# Altium schematic sheet base_led_cube.SchDoc
size A4
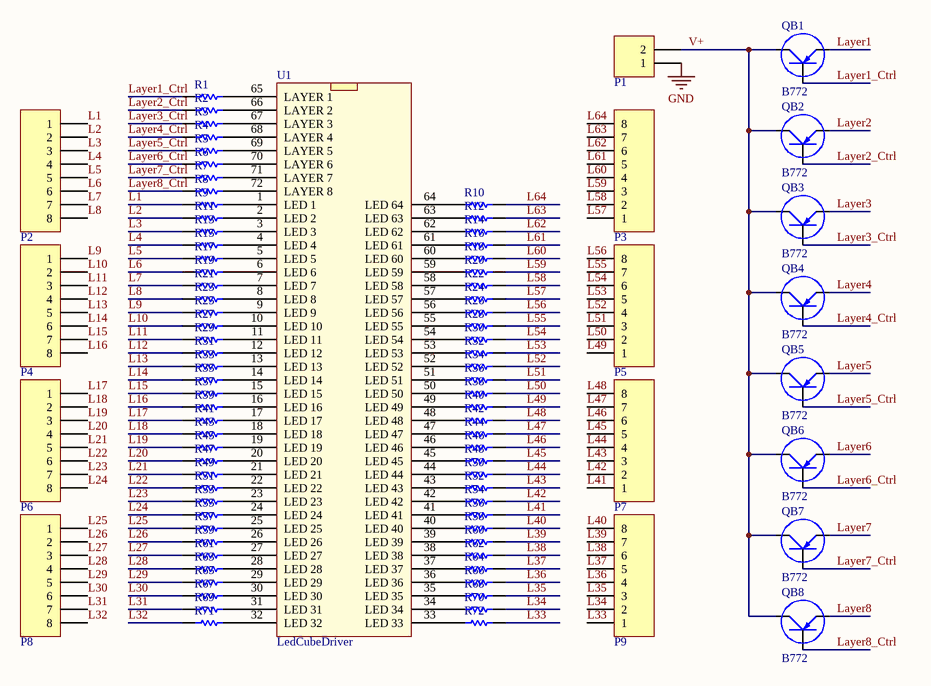
[diagram p0: base_led_cube.SchDoc]

## Parts
P1  Domino 2  [DOMINO SMALL 2]  (value not drawn)
P2  Header 8  [JP8]  (value not drawn)
P3  Header 8  [JP8]  (value not drawn)
P4  Header 8  [JP8]  (value not drawn)
P5  Header 8  [JP8]  (value not drawn)
P6  Header 8  [JP8]  (value not drawn)
P7  Header 8  [JP8]  (value not drawn)
P8  Header 8  [JP8]  (value not drawn)
P9  Header 8  [JP8]  (value not drawn)
QB1  B772  [To-126]
QB2  B772  [To-126]
QB3  B772  [To-126]
QB4  B772  [To-126]
QB5  B772  [To-126]
QB6  B772  [To-126]
QB7  B772  [To-126]
QB8  B772  [To-126]
R1  RESISTOR SMD  [RES-SM-0805]  (value not drawn)
R2  RESISTOR SMD  [RES-SM-0805]  (value not drawn)
R3  RESISTOR SMD  [RES-SM-0805]  (value not drawn)
R4  RESISTOR SMD  [RES-SM-0805]  (value not drawn)
R5  RESISTOR SMD  [RES-SM-0805]  (value not drawn)
R6  RESISTOR SMD  [RES-SM-0805]  (value not drawn)
R7  RESISTOR SMD  [RES-SM-0805]  (value not drawn)
R8  RESISTOR SMD  [RES-SM-0805]  (value not drawn)
R9  RESISTOR SMD  [RES-SM-0805]  (value not drawn)
R10  RESISTOR SMD  [RES-SM-0805]  (value not drawn)
R11  RESISTOR SMD  [RES-SM-0805]  (value not drawn)
R12  RESISTOR SMD  [RES-SM-0805]  (value not drawn)
R13  RESISTOR SMD  [RES-SM-0805]  (value not drawn)
R14  RESISTOR SMD  [RES-SM-0805]  (value not drawn)
R15  RESISTOR SMD  [RES-SM-0805]  (value not drawn)
R16  RESISTOR SMD  [RES-SM-0805]  (value not drawn)
R17  RESISTOR SMD  [RES-SM-0805]  (value not drawn)
R18  RESISTOR SMD  [RES-SM-0805]  (value not drawn)
R19  RESISTOR SMD  [RES-SM-0805]  (value not drawn)
R20  RESISTOR SMD  [RES-SM-0805]  (value not drawn)
R21  RESISTOR SMD  [RES-SM-0805]  (value not drawn)
R22  RESISTOR SMD  [RES-SM-0805]  (value not drawn)
R23  RESISTOR SMD  [RES-SM-0805]  (value not drawn)
R24  RESISTOR SMD  [RES-SM-0805]  (value not drawn)
R25  RESISTOR SMD  [RES-SM-0805]  (value not drawn)
R26  RESISTOR SMD  [RES-SM-0805]  (value not drawn)
R27  RESISTOR SMD  [RES-SM-0805]  (value not drawn)
R28  RESISTOR SMD  [RES-SM-0805]  (value not drawn)
R29  RESISTOR SMD  [RES-SM-0805]  (value not drawn)
R30  RESISTOR SMD  [RES-SM-0805]  (value not drawn)
R31  RESISTOR SMD  [RES-SM-0805]  (value not drawn)
R32  RESISTOR SMD  [RES-SM-0805]  (value not drawn)
R33  RESISTOR SMD  [RES-SM-0805]  (value not drawn)
R34  RESISTOR SMD  [RES-SM-0805]  (value not drawn)
R35  RESISTOR SMD  [RES-SM-0805]  (value not drawn)
R36  RESISTOR SMD  [RES-SM-0805]  (value not drawn)
R37  RESISTOR SMD  [RES-SM-0805]  (value not drawn)
R38  RESISTOR SMD  [RES-SM-0805]  (value not drawn)
R39  RESISTOR SMD  [RES-SM-0805]  (value not drawn)
R40  RESISTOR SMD  [RES-SM-0805]  (value not drawn)
R41  RESISTOR SMD  [RES-SM-0805]  (value not drawn)
R42  RESISTOR SMD  [RES-SM-0805]  (value not drawn)
R43  RESISTOR SMD  [RES-SM-0805]  (value not drawn)
R44  RESISTOR SMD  [RES-SM-0805]  (value not drawn)
R45  RESISTOR SMD  [RES-SM-0805]  (value not drawn)
R46  RESISTOR SMD  [RES-SM-0805]  (value not drawn)
R47  RESISTOR SMD  [RES-SM-0805]  (value not drawn)
R48  RESISTOR SMD  [RES-SM-0805]  (value not drawn)
R49  RESISTOR SMD  [RES-SM-0805]  (value not drawn)
R50  RESISTOR SMD  [RES-SM-0805]  (value not drawn)
R51  RESISTOR SMD  [RES-SM-0805]  (value not drawn)
R52  RESISTOR SMD  [RES-SM-0805]  (value not drawn)
R53  RESISTOR SMD  [RES-SM-0805]  (value not drawn)
R54  RESISTOR SMD  [RES-SM-0805]  (value not drawn)
R55  RESISTOR SMD  [RES-SM-0805]  (value not drawn)
R56  RESISTOR SMD  [RES-SM-0805]  (value not drawn)
R57  RESISTOR SMD  [RES-SM-0805]  (value not drawn)
R58  RESISTOR SMD  [RES-SM-0805]  (value not drawn)
R59  RESISTOR SMD  [RES-SM-0805]  (value not drawn)
R60  RESISTOR SMD  [RES-SM-0805]  (value not drawn)
R61  RESISTOR SMD  [RES-SM-0805]  (value not drawn)
R62  RESISTOR SMD  [RES-SM-0805]  (value not drawn)
R63  RESISTOR SMD  [RES-SM-0805]  (value not drawn)
R64  RESISTOR SMD  [RES-SM-0805]  (value not drawn)
R65  RESISTOR SMD  [RES-SM-0805]  (value not drawn)
R66  RESISTOR SMD  [RES-SM-0805]  (value not drawn)
R67  RESISTOR SMD  [RES-SM-0805]  (value not drawn)
R68  RESISTOR SMD  [RES-SM-0805]  (value not drawn)
R69  RESISTOR SMD  [RES-SM-0805]  (value not drawn)
R70  RESISTOR SMD  [RES-SM-0805]  (value not drawn)
R71  RESISTOR SMD  [RES-SM-0805]  (value not drawn)
R72  RESISTOR SMD  [RES-SM-0805]  (value not drawn)
U1  LedCubeDriver  [LED CUBE Driver]

## Nets
GND: P1.1
L1: P2.1 R9.1
L2: P2.2 R11.1
L3: P2.3 R13.1
L4: P2.4 R15.1
L5: P2.5 R17.1
L6: P2.6 R19.1
L7: P2.7 R21.1
L8: P2.8 R23.1
L9: P4.1 R25.1
L10: P4.2 R27.1
L11: P4.3 R29.1
L12: P4.4 R31.1
L13: P4.5 R33.1
L14: P4.6 R35.1
L15: P4.7 R37.1
L16: P4.8 R39.1
L17: P6.1 R41.1
L18: P6.2 R43.1
L19: P6.3 R45.1
L20: P6.4 R47.1
L21: P6.5 R49.1
L22: P6.6 R51.1
L23: P6.7 R53.1
L24: P6.8 R55.1
L25: P8.1 R57.1
L26: P8.2 R59.1
L27: P8.3 R61.1
L28: P8.4 R63.1
L29: P8.5 R65.1
L30: P8.6 R67.1
L31: P8.7 R69.1
L32: P8.8 R71.1
L33: P9.1 R72.1
L34: P9.2 R70.1
L35: P9.3 R68.1
L36: P9.4 R66.1
L37: P9.5 R64.1
L38: P9.6 R62.1
L39: P9.7 R60.1
L40: P9.8 R58.1
L41: P7.1 R56.1
L42: P7.2 R54.1
L43: P7.3 R52.1
L44: P7.4 R50.1
L45: P7.5 R48.1
L46: P7.6 R46.1
L47: P7.7 R44.1
L48: P7.8 R42.1
L49: P5.1 R40.1
L50: P5.2 R38.1
L51: P5.3 R36.1
L52: P5.4 R34.1
L53: P5.5 R32.1
L54: P5.6 R30.1
L55: P5.7 R28.1
L56: P5.8 R26.1
L57: P3.1 R24.1
L58: P3.2 R22.1
L59: P3.3 R20.1
L60: P3.4 R18.1
L61: P3.5 R16.1
L62: P3.6 R14.1
L63: P3.7 R12.1
L64: P3.8 R10.1
Layer1: QB1.3(E)
Layer1_Ctrl: QB1.1(B) R1.1
Layer2: QB2.3(E)
Layer2_Ctrl: QB2.1(B) R2.1
Layer3: QB3.3(E)
Layer3_Ctrl: QB3.1(B) R3.1
Layer4: QB4.3(E)
Layer4_Ctrl: QB4.1(B) R4.1
Layer5: QB5.3(E)
Layer5_Ctrl: QB5.1(B) R5.1
Layer6: QB6.3(E)
Layer6_Ctrl: QB6.1(B) R6.1
Layer7: QB7.3(E)
Layer7_Ctrl: QB7.1(B) R7.1
Layer8: QB8.3(E)
Layer8_Ctrl: QB8.1(B) R8.1
V+: P1.2 QB1.2(C) QB2.2(C) QB3.2(C) QB4.2(C) QB5.2(C) QB6.2(C) QB7.2(C) QB8.2(C)
NetR1_2: R1.2 U1.65(LAYER_1)
NetR2_2: R2.2 U1.66(LAYER_2)
NetR3_2: R3.2 U1.67(LAYER_3)
NetR4_2: R4.2 U1.68(LAYER_4)
NetR5_2: R5.2 U1.69(LAYER_5)
NetR6_2: R6.2 U1.70(LAYER_6)
NetR7_2: R7.2 U1.71(LAYER_7)
NetR8_2: R8.2 U1.72(LAYER_8)
NetR9_2: R9.2 U1.1(LED_1)
NetR10_2: R10.2 U1.64(LED_64)
NetR11_2: R11.2 U1.2(LED_2)
NetR12_2: R12.2 U1.63(LED_63)
NetR13_2: R13.2 U1.3(LED_3)
NetR14_2: R14.2 U1.62(LED_62)
NetR15_2: R15.2 U1.4(LED_4)
NetR16_2: R16.2 U1.61(LED_61)
NetR17_2: R17.2 U1.5(LED_5)
NetR18_2: R18.2 U1.60(LED_60)
NetR19_2: R19.2 U1.6(LED_6)
NetR20_2: R20.2 U1.59(LED_59)
NetR21_2: R21.2 U1.7(LED_7)
NetR22_2: R22.2 U1.58(LED_58)
NetR23_2: R23.2 U1.8(LED_8)
NetR24_2: R24.2 U1.57(LED_57)
NetR25_2: R25.2 U1.9(LED_9)
NetR26_2: R26.2 U1.56(LED_56)
NetR27_2: R27.2 U1.10(LED_10)
NetR28_2: R28.2 U1.55(LED_55)
NetR29_2: R29.2 U1.11(LED_11)
NetR30_2: R30.2 U1.54(LED_54)
NetR31_2: R31.2 U1.12(LED_12)
NetR32_2: R32.2 U1.53(LED_53)
NetR33_2: R33.2 U1.13(LED_13)
NetR34_2: R34.2 U1.52(LED_52)
NetR35_2: R35.2 U1.14(LED_14)
NetR36_2: R36.2 U1.51(LED_51)
NetR37_2: R37.2 U1.15(LED_15)
NetR38_2: R38.2 U1.50(LED_50)
NetR39_2: R39.2 U1.16(LED_16)
NetR40_2: R40.2 U1.49(LED_49)
NetR41_2: R41.2 U1.17(LED_17)
NetR42_2: R42.2 U1.48(LED_48)
NetR43_2: R43.2 U1.18(LED_18)
NetR44_2: R44.2 U1.47(LED_47)
NetR45_2: R45.2 U1.19(LED_19)
NetR46_2: R46.2 U1.46(LED_46)
NetR47_2: R47.2 U1.20(LED_20)
NetR48_2: R48.2 U1.45(LED_45)
NetR49_2: R49.2 U1.21(LED_21)
NetR50_2: R50.2 U1.44(LED_44)
NetR51_2: R51.2 U1.22(LED_22)
NetR52_2: R52.2 U1.43(LED_43)
NetR53_2: R53.2 U1.23(LED_23)
NetR54_2: R54.2 U1.42(LED_42)
NetR55_2: R55.2 U1.24(LED_24)
NetR56_2: R56.2 U1.41(LED_41)
NetR57_2: R57.2 U1.25(LED_25)
NetR58_2: R58.2 U1.40(LED_40)
NetR59_2: R59.2 U1.26(LED_26)
NetR60_2: R60.2 U1.39(LED_39)
NetR61_2: R61.2 U1.27(LED_27)
NetR62_2: R62.2 U1.38(LED_38)
NetR63_2: R63.2 U1.28(LED_28)
NetR64_2: R64.2 U1.37(LED_37)
NetR65_2: R65.2 U1.29(LED_29)
NetR66_2: R66.2 U1.36(LED_36)
NetR67_2: R67.2 U1.30(LED_30)
NetR68_2: R68.2 U1.35(LED_35)
NetR69_2: R69.2 U1.31(LED_31)
NetR70_2: R70.2 U1.34(LED_34)
NetR71_2: R71.2 U1.32(LED_32)
NetR72_2: R72.2 U1.33(LED_33)

## Library data of the parts
P1 = Domino 2: Domino, 2-Pin; LatestRevisionDate: 17-Jul-2002; LatestRevisionNote: Re-released for DXP Platform.; Publisher: Altium Limited
P2-P9 = Header 8: Header, 8-Pin; LatestRevisionDate: 17-Jul-2002; LatestRevisionNote: Re-released for DXP Platform.; Publisher: Altium Limited
QB1-QB8 = 2SB772: PNP 30V - 3A
R1-R8 = RESISTOR SMD: Resistor; Value: 1K
R9-R72 = RESISTOR SMD: Resistor; Value: 100
U1 = LED Cube Driver